# EAGLE design my-hello-world (EAGLE 8.5.2)
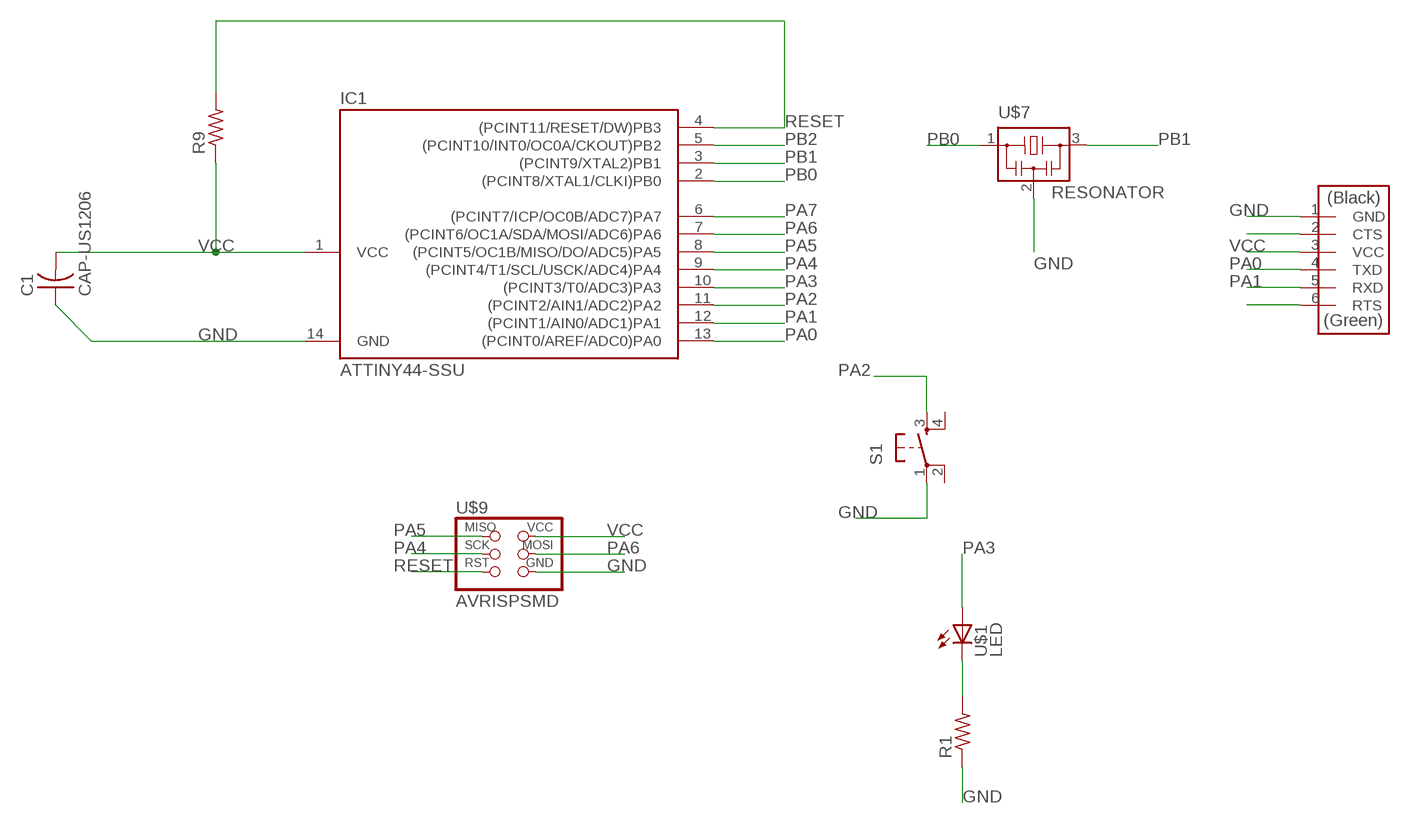
[diagram p0: schematic, sheet 1]

## Parts
C1  CAP-US1206  [C1206]
IC1  ATTINY44-SSU  [SOIC14]
R1  RES-US1206  [R1206]
R9  RES-US1206  [R1206]
S1  6MM_SWITCH6MM_SWITCH  [6MM_SWITCH]
U$1  LED  [LED1206]
U$7  RESONATOR  [EFOBM]
U$9  AVRISPSMD  [2X03SMD]
U$10  FTDI-SMD-HEADER  [1X06SMD]

## Nets
GND: C1.1 IC1.14(GND) R1.1 S1.1(P) U$7.2 U$9.6(GND) U$10.1(GND)
N$8: U$10.2(CTS)
N$12: U$10.6(RTS)
PA0: IC1.13((PCINT0/AREF/ADC0)PA0) U$10.4(TXD)
PA1: IC1.12((PCINT1/AIN0/ADC1)PA1) U$10.5(RXD)
PA2: IC1.11((PCINT2/AIN1/ADC2)PA2) S1.3(S)
PA3: IC1.10((PCINT3/T0/ADC3)PA3) U$1.1(A)
PA4: IC1.9((PCINT4/T1/SCL/USCK/ADC4)PA4) U$9.3(SCK)
PA5: IC1.8((PCINT5/OC1B/MISO/DO/ADC5)PA5) U$9.1(MISO)
PA6: IC1.7((PCINT6/OC1A/SDA/MOSI/ADC6)PA6) U$9.4(MOSI)
PA7: IC1.6((PCINT7/ICP/OC0B/ADC7)PA7)
PB0: IC1.2((PCINT8/XTAL1/CLKI)PB0) U$7.1
PB1: IC1.3((PCINT9/XTAL2)PB1) U$7.3
PB2: IC1.5((PCINT10/INT0/OC0A/CKOUT)PB2)
R-LED-1: R1.2 U$1.2(C)
RESET: IC1.4((PCINT11/RESET/DW)PB3) R9.2 U$9.5(RST)
VCC: C1.2 IC1.1(VCC) R9.1 U$9.2(VCC) U$10.3(VCC)
Unconnected: S1.2(P1) S1.4(S1)

## Library data of the parts
C1 = fab:CAP-US
IC1 = fab:ATTINY44
R1 R9 = fab:RES-US: Resistor (US Symbol) Variants with postfix FAB are widened to allow the routing of internal traces
S1 = fab:6MM_SWITCH: OMRON SWITCH
U$1 = fab:LED: LED
U$7 = fab:RESONATOR
U$9 = fab:AVRISP
U$10 = fab:FTDI-SMD-HEADER

## Board
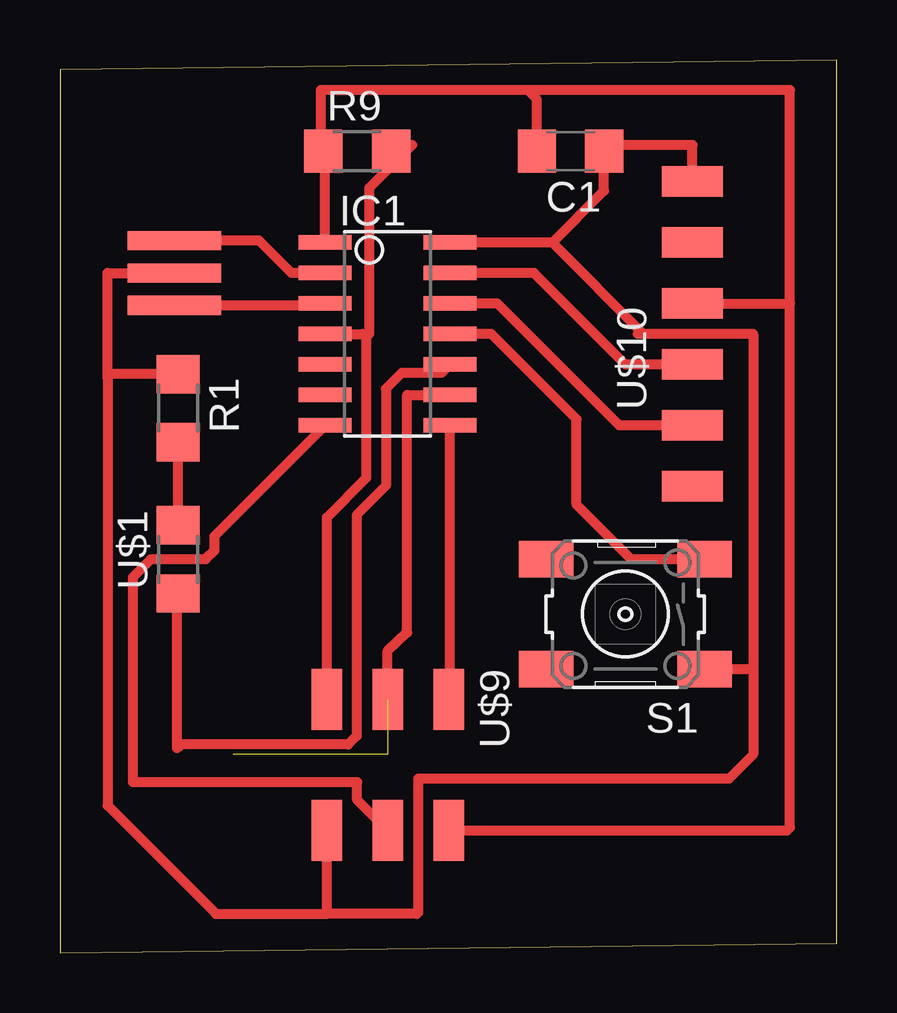
[diagram p1: board, top side]

Size 32.39 x 37.23 mm. Coordinates in mm from the lower left corner, seen from the top.
Outline: 0,0 32.39,0.41 32.39,37.23 0,36.82 0,0
Copper layers (1*16): Top 0.035mm / dielectric 1.5mm / Bottom 0.035mm
Design rules "default *": minimum track width 6mil, minimum drill 0.35mm, track to track 16mil, track to pad 16mil, pad to pad 16mil, via to via 16mil, smd to smd 16mil, copper to edge 40mil, drill to drill 6mil, minimum pad ring 10mil, minimum via ring 8mil, stop-mask expansion 4mil, vias tented up to drill 0mil, thermal gap 10mil

### Footprints (pad centres in the part's own frame; a part is rotated, then mirrored left to right if it is on the bottom)
C1206 = smd 1.6 x 1.8: 1 -1.4,0; 2 1.4,0
SOIC14 = smd 0.61 x 2.21: 1 -3.81,-2.603; 2 -2.54,-2.603; 3 -1.27,-2.603; 4 0,-2.603; 5 1.27,-2.603; 6 2.54,-2.603; 7 3.81,-2.603; 8 3.81,2.603; 9 2.54,2.603; 10 1.27,2.603; 11 0,2.603; 12 -1.27,2.603; 13 -2.54,2.603; 14 -3.81,2.603
R1206 = smd 1.6 x 1.803: 1 -1.422,0; 2 1.422,0
6MM_SWITCH = smd 2.286 x 1.524: 1 -3.302,2.286; 2 3.302,2.286; 3 -3.302,-2.286; 4 3.302,-2.286
LED1206 = smd 1.6 x 1.803: 1 -1.422,0; 2 1.422,0
EFOBM = smd 0.8 x 3.9: 1 -1.35,0; 2 0,0; 3 1.35,0
2X03SMD = smd 2.54 x 1.27: 1 -2.54,2.54; 2 2.92,2.54; 3 -2.54,0; 4 2.92,0; 5 -2.54,-2.54; 6 2.92,-2.54
1X06SMD = smd 2.54 x 1.27: 1 0,6.35; 2 0,3.81; 3 0,1.27; 4 0,-1.27; 5 0,-3.81; 6 0,-6.35

### Placement (x,y rotation side)
C1  21.29,33.43 180 top
IC1  13.67,25.81 270 top
R1  4.93,22.71 270 top
R9  12.4,33.43 0 top
S1  23.57,14.12 180 top
U$1  4.93,16.41 90 top
U$7  4.78,28.35 270 top
U$9  13.67,8.03 270 top
U$10  26.37,25.81 0 top

### Tracks (layer width: path | path; a pad name or v marks a point on that pad's centre or on a via)
GND
  Top 0.406: 11.13,1.63 U$9.6 | 11.13,1.63 6.5,1.63 1.98,6.15 1.98,23.98 | U$10.1 26.37,33.68 22.94,33.68 C1.1 22.69,31.78 20.52,29.62 | 24.33,25.81 28.91,25.81 28.91,11.84 | 24.33,25.81 24.08,25.81 | 28.91,11.84 28.91,8.28 27.89,7.26 14.94,7.26 14.94,1.68 14.88,1.63 11.13,1.63 | S1.1 28.91,11.84 | 24.33,25.81 20.52,29.62 | 20.52,29.62 IC1.14 | U$7.2 1.98,28.35 1.98,23.98 | R1.1 2.13,24.13 1.98,23.98
PA0
  Top 0.406: U$10.4 23.57,24.54 19.76,28.35 IC1.13
PA1
  Top 0.406: U$10.5 23.32,22 18.24,27.08 IC1.12
PA2
  Top 0.406: S1.3 23.83,16.41 21.54,18.69 21.54,22.25 17.98,25.81 17.22,25.81 IC1.11 17.48,25.81
PA3
  Top 0.406: IC1.10 15.91,24.18 14.24,24.18 13.59,23.53 13.59,19.48 12.37,18.26 12.37,9.04 12.01,8.69 5.03,8.69 4.88,8.53 4.88,14.94 U$1.1
PA4  (2 unrouted)
  Top 0.406: IC1.9 14.48,23.27 14.48,13.36 13.67,12.6 U$9.3
PA5
  Top 0.406: 16.46,10.82 U$9.1 16.27,10.63 IC1.8
PA6
  Top 0.406: U$9.4 12.4,6.38 12.4,7.11 3.05,7.11 3.05,15.67 3.8,16.42 6.08,16.42 6.44,16.78 6.44,17.37 IC1.7
PB0
  Top 0.406: IC1.2 9.65,28.35 8.3,29.7 U$7.1
PB1
  Top 0.406: 4.86,27.08 U$7.3 10.36,27 10.44,27.08 IC1.3 10.62,27.08 10.54,27
R-LED-1
  Top 0.406: U$1.2 R1.2
RESET
  Top 0.406: 14.43,33.43 12.9,31.9 12.9,25.81 12.6,25.81 | 14.68,33.68 14.43,33.43 | 14.43,33.43 R9.2 | IC1.4 12.6,25.81 | 12.6,25.81 12.78,25.63 12.78,19.81 11.13,18.16 U$9.5
VCC
  Top 0.406: 19.51,35.97 10.87,35.97 10.87,33.68 | 10.87,33.68 10.87,33.53 R9.1 | IC1.1 11.06,33.49 10.87,33.68 | U$10.3 30.43,27.08 | 19.51,35.97 30.43,35.97 30.43,27.08 | C1.2 19.89,35.59 19.51,35.97 | U$9.2 30.3,5.11 30.43,5.23 30.43,27.08